# EAGLE design brainwave (EAGLE 6.2)
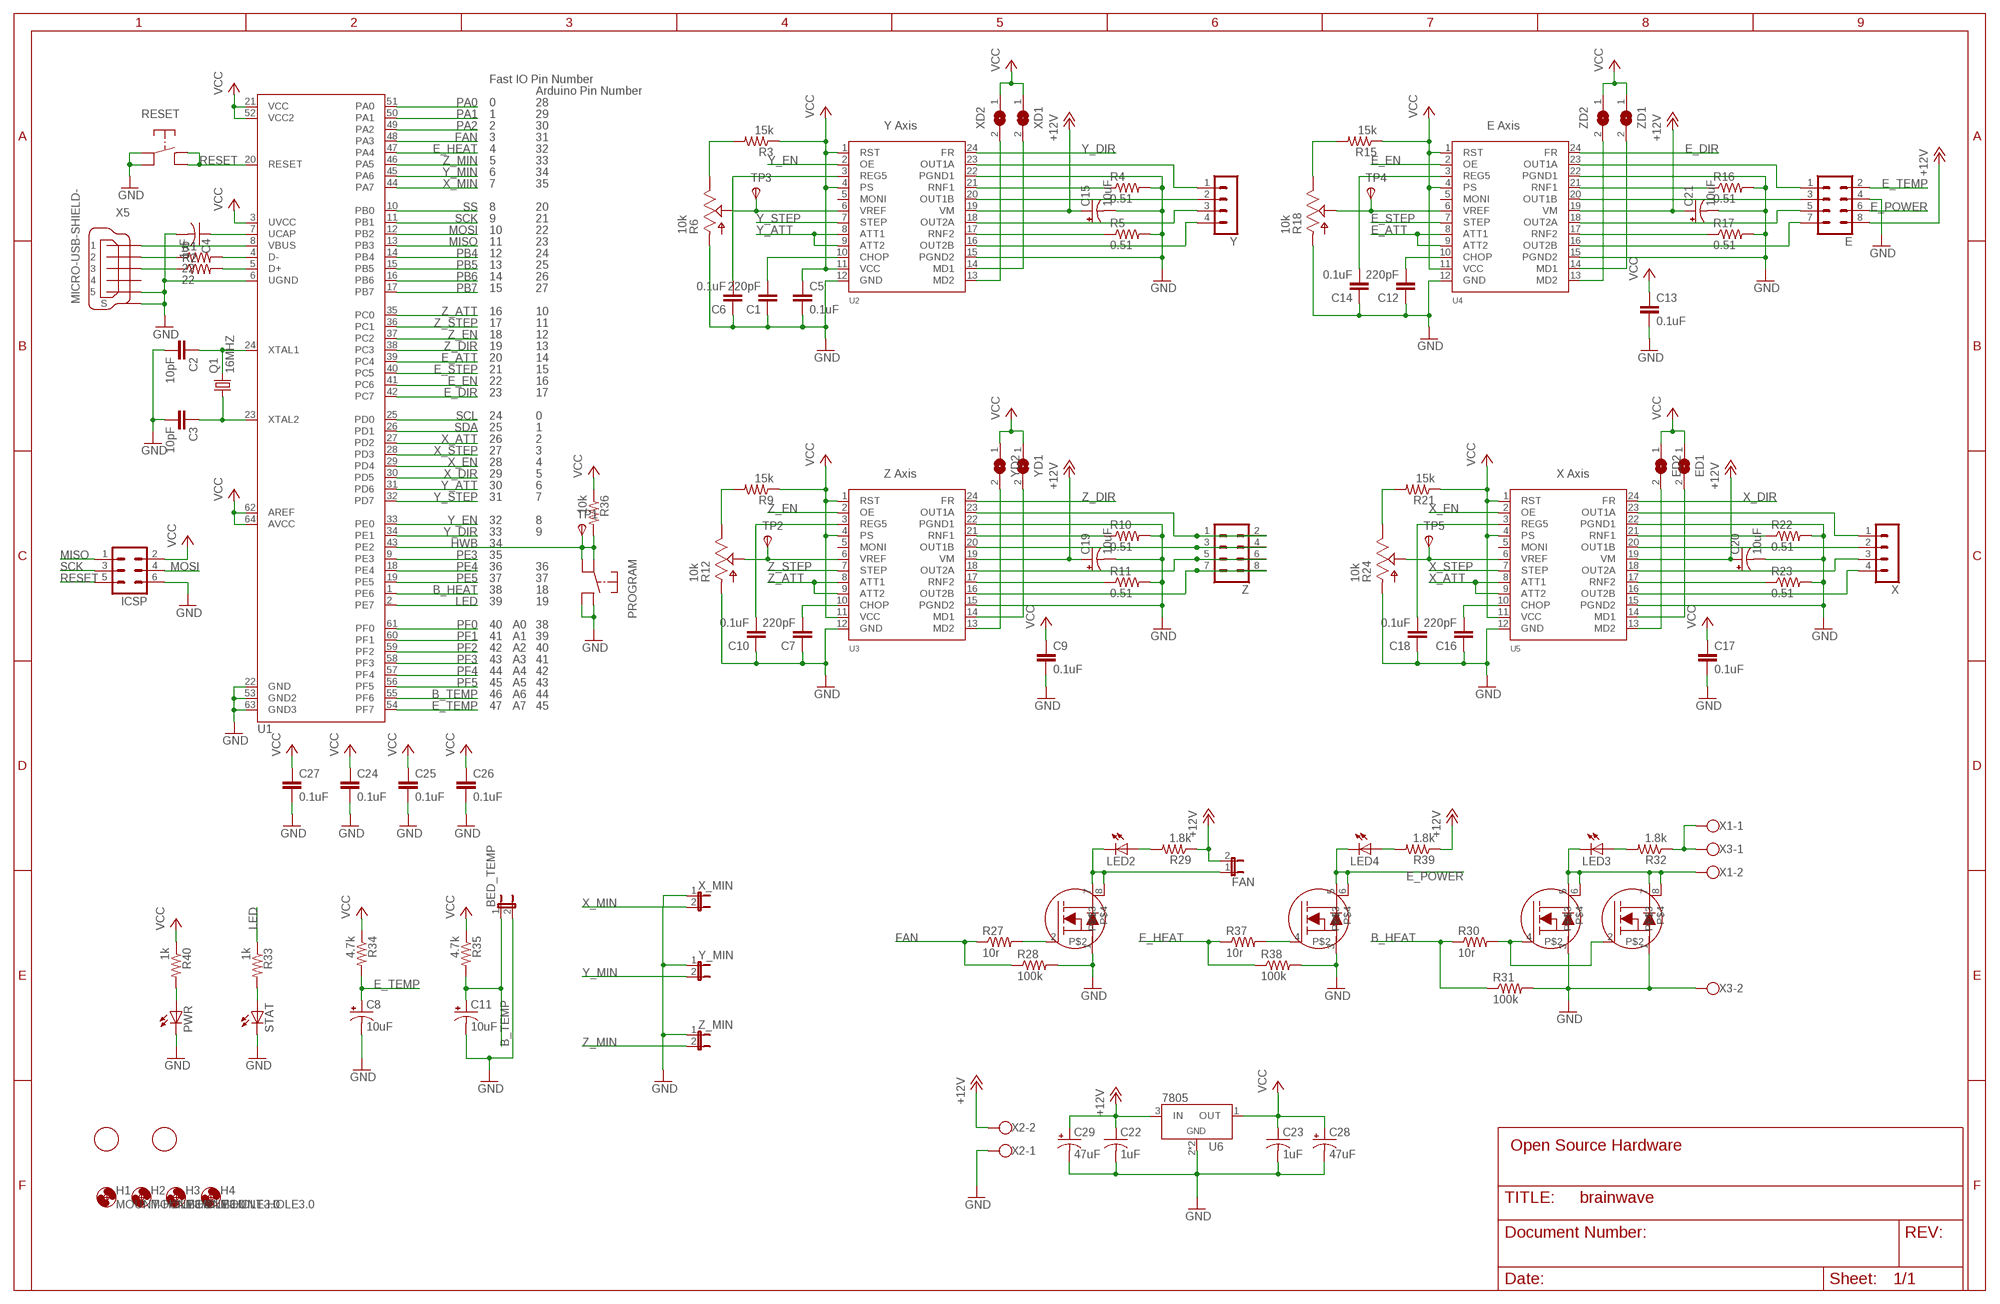
[diagram p0: schematic, sheet 1]

## Parts
BED_TEMP  JP1E  [JP1]
C1  220pF  C-EUC0603  [C0603]
C2  10pF  C-EUC0603  [C0603]
C3  10pF  C-EUC0603  [C0603]
C4  1uF  C-USC0603  [C0603]
C5  0.1uF  C-EUC0603  [C0603]
C6  0.1uF  C-EUC0603  [C0603]
C7  220pF  C-EUC0603  [C0603]
C8  10uF  CPOL-US153CLV-0505  [153CLV-0505]
C9  0.1uF  C-EUC0603  [C0603]
C10  0.1uF  C-EUC0603  [C0603]
C11  10uF  CPOL-US153CLV-0505  [153CLV-0505]
C12  220pF  C-EUC0603  [C0603]
C13  0.1uF  C-EUC0603  [C0603]
C14  0.1uF  C-EUC0603  [C0603]
C15  10uF  CPOL-US153CLV-0505  [153CLV-0505]
C16  220pF  C-EUC0603  [C0603]
C17  0.1uF  C-EUC0603  [C0603]
C18  0.1uF  C-EUC0603  [C0603]
C19  10uF  CPOL-US153CLV-0505  [153CLV-0505]
C20  10uF  CPOL-US153CLV-0505  [153CLV-0505]
C21  10uF  CPOL-US153CLV-0505  [153CLV-0505]
C22  1uF  C-USC0603  [C0603]
C23  1uF  C-USC0603  [C0603]
C24  0.1uF  C-EUC0603  [C0603]
C25  0.1uF  C-EUC0603  [C0603]
C26  0.1uF  C-EUC0603  [C0603]
C27  0.1uF  C-EUC0603  [C0603]
C28  47uF  CPOL-US153CLV-0605  [153CLV-0605]
C29  47uF  CPOL-US153CLV-0605  [153CLV-0605]
E  MA04-2  [MA04-2]
ED1  SJ  [SJ]
ED2  SJ  [SJ]
FAN  JP1E  [JP1]
H1  MOUNT-HOLE3.0  [3,0]
H2  MOUNT-HOLE3.0  [3,0]
H3  MOUNT-HOLE3.0  [3,0]
H4  MOUNT-HOLE3.0  [3,0]
ICSP  MA03-2  [MA03-2]
LED2  LEDCHIPLED_0805  [CHIPLED_0805]
LED3  LEDCHIPLED_0805  [CHIPLED_0805]
LED4  LEDCHIPLED_0805  [CHIPLED_0805]
PROGRAM  PTS645SMT  [PTS645-SMTR]
PWR  LEDCHIPLED_0805  [CHIPLED_0805]
Q1  16MHZ  CRYSTALCSM-3X  [CSM-3X]
R1  22  R-US_R0603  [R0603]
R2  22  R-US_R0603  [R0603]
R3  15k  R-US_R0603  [R0603]
R4  0.51  R-US_R2512  [R2512]
R5  0.51  R-US_R2512  [R2512]
R6  10k  PVZ3A  [PVZ3A]
R9  15k  R-US_R0603  [R0603]
R10  0.51  R-US_R2512  [R2512]
R11  0.51  R-US_R2512  [R2512]
R12  10k  PVZ3A  [PVZ3A]
R15  15k  R-US_R0603  [R0603]
R16  0.51  R-US_R2512  [R2512]
R17  0.51  R-US_R2512  [R2512]
R18  10k  PVZ3A  [PVZ3A]
R21  15k  R-US_R0603  [R0603]
R22  0.51  R-US_R2512  [R2512]
R23  0.51  R-US_R2512  [R2512]
R24  10k  PVZ3A  [PVZ3A]
R27  10r  R-US_R0603  [R0603]
R28  100k  R-US_R0603  [R0603]
R29  1.8k  R-US_R0603  [R0603]
R30  10r  R-US_R0603  [R0603]
R31  100k  R-US_R0603  [R0603]
R32  1.8k  R-US_R0603  [R0603]
R33  1k  R-US_R0603  [R0603]
R34  4.7k  R-US_R0603  [R0603]
R35  4.7k  R-US_R0603  [R0603]
R36  10k  R-US_R0603  [R0603]
R37  10r  R-US_R0603  [R0603]
R38  100k  R-US_R0603  [R0603]
R39  1.8k  R-US_R0603  [R0603]
R40  1k  R-US_R0603  [R0603]
RESET  PTS645SMT  [PTS645-SMTR]
STAT  LEDCHIPLED_0805  [CHIPLED_0805]
TP1  TPSTP08R  [TP08R]
TP2  TPSTP08R  [TP08R]
TP3  TPSTP08R  [TP08R]
TP4  TPSTP08R  [TP08R]
TP5  TPSTP08R  [TP08R]
U1  AT90USB64/128  [TQFP64]
U2  LV8713T  [TSSOP24]
U3  LV8713T  [TSSOP24]
U4  LV8713T  [TSSOP24]
U5  LV8713T  [TSSOP24]
U6  7805  78  [SOT89]
U7  IRF8313PBF  [SO8]
U8  IRF8313PBF  [SO8]
U$1  FIDUCIAL  [FIDUCIAL_1MM]
U$2  FIDUCIAL  [FIDUCIAL_1MM]
X  MA04-1  [MA04-1]
X1  W237-102  [W237-102]
X2  W237-102  [W237-102]
X3  W237-102  [W237-102]
X5  MICRO-USB-SHIELD-  [10118192-0001LF]
X_MIN  JP1E  [JP1]
XD1  SJ  [SJ]
XD2  SJ  [SJ]
Y  MA04-1  [MA04-1]
Y_MIN  JP1E  [JP1]
YD1  SJ  [SJ]
YD2  SJ  [SJ]
Z  MA04-2  [MA04-2]
Z_MIN  JP1E  [JP1]
ZD1  SJ  [SJ]
ZD2  SJ  [SJ]

## Nets
+12V [Power]: C15.+ C19.+ C20.+ C21.+ C22.1 C29.+ E.8 FAN.2 R29.1 R39.1 U2.19(VM) U3.19(VM) U4.19(VM) U5.19(VM) U6.3(IN) X2.2
B_HEAT: R30.1 R31.1 U1.1(PE6)
B_TEMP: BED_TEMP.1 C11.+ R35.2 U1.55(PF6)
BED_POWER [Power]: R32.1 X1.1 X3.1
E_ATT: U1.39(PC4) U4.8(ATT1) U4.9(ATT2)
E_DIR: U1.42(PC7) U4.24(FR)
E_EN: U1.41(PC6) U4.2(OE)
E_HEAT: R37.1 R38.1 U1.47(PA4)
E_POWER [Power Bus]: E.6 LED4.C U7.5 U7.6
E_STEP: U1.40(PC5) U4.7(STEP)
E_TEMP: C8.+ E.2 R34.2 U1.54(PF7)
FAN: R27.1 R28.1 U1.48(PA3)
GND: BED_TEMP.2 C1.1 C2.2 C3.2 C4.2 C5.2 C6.1 C7.1 C8.- C9.2 C10.1 C11.- C12.1 C13.2 C14.1 C15.- C16.1 C17.2 C18.1 C19.- C20.- C21.- C22.2 C23.2 C24.2 C25.2 C26.2 C27.2 C28.- C29.- E.4 ICSP.6 PROGRAM.P$3 PROGRAM.P$4 PWR.C R4.2 R5.2 R6.P$1 R10.2 R11.2 R12.P$1 R16.2 R17.2 R18.P$1 R22.2 R23.2 R24.P$1 R28.2 R31.2 R38.2 RESET.P$1 RESET.P$2 STAT.C U1.6(UGND) U1.22(GND) U1.53(GND2) U1.63(GND3) U2.12(GND) U2.15(PGND2) U2.22(PGND1) U3.12(GND) U3.15(PGND2) U3.22(PGND1) U4.12(GND) U4.15(PGND2) U4.22(PGND1) U5.12(GND) U5.15(PGND2) U5.22(PGND1) U6.2(GND) U6.2@1(GND) U7.1 U7.3 U8.1 U8.3 X2.1 X3.2 X5.5 X5.M1(S) X5.M2(S) X5.M3(S) X5.M4(S) X5.M5(S) X5.M6(S) X_MIN.1 Y_MIN.1 Z_MIN.1
HWB: PROGRAM.P$1 PROGRAM.P$2 R36.2 TP1.TP(PP) U1.43(PE2)
LED: R33.1 U1.2(PE7)
MISO: ICSP.1 U1.13(PB3)
MOSI: ICSP.4 U1.12(PB2)
N$1: U1.8(VBUS) X5.1
N$2: R1.1 X5.2
N$3: R2.1 X5.3
N$4: U3.20(OUT1B) Z.3 Z.4
N$5: C4.1 U1.7(UCAP)
N$6: C2.1 Q1.2 U1.24(XTAL1)
N$7: C3.1 Q1.1 U1.23(XTAL2)
N$8: R6.P$2 TP3.TP(PP) U2.6(VREF)
N$9: R4.1 U2.21(RNF1)
N$10: R5.1 U2.17(RNF2)
N$11 [Power]: U2.16(OUT2B) Y.4
N$12 [Power]: U2.18(OUT2A) Y.3
N$13 [Power]: U2.20(OUT1B) Y.2
N$14 [Power]: U2.23(OUT1A) Y.1
N$15: C1.2 U2.10(CHOP)
N$16: C6.2 U2.3(REG5)
N$17: R3.2 R6.P$3
N$18: U2.13(MD2) XD2.2
N$19: U2.14(MD1) XD1.2
N$20: R30.2 U8.2 U8.4
N$21: R10.1 U3.21(RNF1)
N$22: R11.1 U3.17(RNF2)
N$23 [Power]: U3.16(OUT2B) Z.7 Z.8
N$24 [Power]: U3.18(OUT2A) Z.5 Z.6
N$26 [Power]: U3.23(OUT1A) Z.1 Z.2
N$27: C7.2 U3.10(CHOP)
N$28: C10.2 U3.3(REG5)
N$29: R12.P$2 TP2.TP(PP) U3.6(VREF)
N$30: R9.2 R12.P$3
N$31: U3.13(MD2) YD2.2
N$32: U3.14(MD1) YD1.2
N$33: R33.2 STAT.A
N$34: R37.2 U7.4
N$36: LED4.A R39.2
N$37: PWR.A R40.2
N$81: R16.1 U4.21(RNF1)
N$82: R17.1 U4.17(RNF2)
N$83 [Power]: E.7 U4.16(OUT2B)
N$84 [Power]: E.5 U4.18(OUT2A)
N$85 [Power]: E.3 U4.20(OUT1B)
N$86 [Power]: E.1 U4.23(OUT1A)
N$87: C12.2 U4.10(CHOP)
N$88: C14.2 U4.3(REG5)
N$89: R18.P$2 TP4.TP(PP) U4.6(VREF)
N$90: R15.2 R18.P$3
N$91: U4.13(MD2) ZD2.2
N$92: U4.14(MD1) ZD1.2
N$93: R22.1 U5.21(RNF1)
N$94: R23.1 U5.17(RNF2)
N$95 [Power]: U5.16(OUT2B) X.4
N$96 [Power]: U5.18(OUT2A) X.3
N$97 [Power]: U5.20(OUT1B) X.2
N$98 [Power]: U5.23(OUT1A) X.1
N$99: C16.2 U5.10(CHOP)
N$100: C18.2 U5.3(REG5)
N$101: R24.P$2 TP5.TP(PP) U5.6(VREF)
N$102: R21.2 R24.P$3
N$103: ED2.2 U5.13(MD2)
N$104: ED1.2 U5.14(MD1)
N$105: R27.2 U7.2
N$107: LED2.A R29.2
N$108 [Power Bus]: FAN.1 LED2.C U7.7 U7.8
N$111 [Bed Heat]: LED3.C U8.5 U8.6 U8.7 U8.8 X1.2
N$112: LED3.A R32.2
PA0: U1.51(PA0)
PA1: U1.50(PA1)
PA2: U1.49(PA2)
PB4: U1.14(PB4)
PB5: U1.15(PB5)
PB6: U1.16(PB6)
PB7: U1.17(PB7)
PE3: U1.9(PE3)
PE4: U1.18(PE4)
PE5: U1.19(PE5)
PF0: U1.61(PF0)
PF1: U1.60(PF1)
PF2: U1.59(PF2)
PF3: U1.58(PF3)
PF4: U1.57(PF4)
PF5: U1.56(PF5)
RESET: ICSP.5 RESET.P$3 RESET.P$4 U1.20(RESET)
SCK: ICSP.3 U1.11(PB1)
SCL: U1.25(PD0)
SDA: U1.26(PD1)
SS [Power]: U1.10(PB0)
USB1_N: R1.2 U1.4(D-)
USB1_P: R2.2 U1.5(D+)
VCC: C5.1 C9.1 C13.1 C17.1 C23.1 C24.1 C25.1 C26.1 C27.1 C28.+ ED1.1 ED2.1 ICSP.2 R3.1 R9.1 R15.1 R21.1 R34.1 R35.1 R36.1 R40.1 U1.3(UVCC) U1.21(VCC) U1.52(VCC2) U1.62(AREF) U1.64(AVCC) U2.1(RST) U2.4(PS) U2.11(VCC) U3.1(RST) U3.4(PS) U3.11(VCC) U4.1(RST) U4.4(PS) U4.11(VCC) U5.1(RST) U5.4(PS) U5.11(VCC) U6.1(OUT) XD1.1 XD2.1 YD1.1 YD2.1 ZD1.1 ZD2.1
X_ATT: U1.27(PD2) U5.8(ATT1) U5.9(ATT2)
X_DIR: U1.30(PD5) U5.24(FR)
X_EN: U1.29(PD4) U5.2(OE)
X_MIN: U1.44(PA7) X_MIN.2
X_STEP: U1.28(PD3) U5.7(STEP)
Y_ATT: U1.31(PD6) U2.8(ATT1) U2.9(ATT2)
Y_DIR: U1.34(PE1) U2.24(FR)
Y_EN: U1.33(PE0) U2.2(OE)
Y_MIN: U1.45(PA6) Y_MIN.2
Y_STEP: U1.32(PD7) U2.7(STEP)
Z_ATT: U1.35(PC0) U3.8(ATT1) U3.9(ATT2)
Z_DIR: U1.38(PC3) U3.24(FR)
Z_EN: U1.37(PC2) U3.2(OE)
Z_MIN: U1.46(PA5) Z_MIN.2
Z_STEP: U1.36(PC1) U3.7(STEP)
Unconnected: U2.5(MONI) U3.5(MONI) U4.5(MONI) U5.5(MONI) X5.4

## Notes on the sheet
- Fast IO Pin Number
- Arduino Pin Number
- 0 | 28
- 1 | 29
- 2 | 30 | Y Axis | E Axis
- 3 | 31
- 4 | 32
- 5 | 33
- 6 | 34
- 7 | 35
- 8 | 20
- 9 | 21
- 10 | 22
- 11 | 23
- 12 | 24
- 13 | 25
- 14 | 26
- 15 | 27
- 16 | 10
- 17 | 11
- 18 | 12
- 19 | 13
- 20 | 14
- 21 | 15
- 22 | 16
- 23 | 17
- 24 | 0
- 25 | 1
- 26 | 2
- 27 | 3
- 28 | 4
- 29 | 5 | Z Axis | X Axis
- 30 | 6
- 31 | 7
- 32 | 8
- 33 | 9
- 34
- 35
- 36 | 36
- 37 | 37
- 38 | 18
- 39 | 19
- 40 | A0 | 38
- 41 | A1 | 39
- 42 | A2 | 40
- 43 | A3 | 41
- 44 | A4 | 42
- 45 | A5 | 43
- 46 | A6 | 44
- 47 | A7 | 45
- Open Source Hardware

## Library data of the parts
BED_TEMP FAN X_MIN Y_MIN Z_MIN = jumper:JP1E: JUMPER
C1-C3 C5-C7 C9 C10 C12-C14 C16-C18 C24-C27 = rcl:C-EU: CAPACITOR, European symbol
C4 C22 C23 = rcl:C-US: CAPACITOR, American symbol
C8 C11 C15 C19-C21 C28 C29 = rcl:CPOL-US: POLARIZED CAPACITOR, American symbol
E Z = con-lstb:MA04-2: PIN HEADER; OC_FARNELL: unknown; OC_NEWARK: unknown
ED1 ED2 XD1 XD2 YD1 YD2 ZD1 ZD2 = jumper:SJ: SMD solder JUMPER
H1-H4 = holes:MOUNT-HOLE: MOUNTING HOLE with drill center marker
ICSP = con-lstb:MA03-2: PIN HEADER; OC_FARNELL: unknown; OC_NEWARK: unknown
LED2-LED4 PWR STAT = led:LED: LED OSRAM: - CHIPLED LG R971, LG N971, LY N971, LG Q971, LY Q971, LO R971, LY R971 LH N974, LH R974 LS Q976, LO Q976, LY Q976 LO Q996 - Hyper CHIPLED LW Q18S LB Q993, LB Q99A, LB R99A - SideLED LS A670, LO A670, LY A670, LG A670, LP A670 LB A673, LV A673, LT A673, LW A673 LH A674 LY A675 LS A676, LA A676, LO A676, LY A676, LW A676 LS A679, LY A679, LG A679 - Hyper Micro SIDELED® LS Y876, LA Y876, LO Y876, LY Y876 LT Y87S - SmartLED LW L88C, LW L88S LB L89C, LB L89S, LG L890 LS L89K, LO L89K, LY L89K LS L896, LA L896, LO L896, LY L896 - TOPLED LS T670, LO T670, LY T670, LG T670, LP T670 LSG T670, LSP T670, LSY T670, LOP T670, LYG T670 LG T671, LOG T671, LSG T671 LB T673, LV T673, LT T673, LW T673 LH T674 LS T676, LA T676, LO T676, LY T676, LB T676, LH T676, LSB T676, LW T676 LB T67C, LV T67C, LT T67C, LS T67K, LO T67K, LY T67K, LW E67C LS E67B, LA E67B, LO E67B, LY E67B, LB E67C, LV E67C, LT E67C LW T67C LS T679, LY T679, LG T679 LS T770, LO T770, LY T770, LG T770, LP T770 LB T773, LV T773, LT T773, LW T773 LH T774 LS E675, LA E675, LY E675, LS T675 LS T776, LA T776, LO T776, LY T776, LB T776 LHGB T686 LT T68C, LB T68C - Hyper Mini TOPLED® LB M676 - Mini TOPLED Santana® LG M470 LS M47K, LO M47K, LY M47K Source: http://www.osram.convergy.de LUXEON: - LUMILED® LXK2-PW12-R00, LXK2-PW12-S00, LXK2-PW14-U00, LXK2-PW14-V00 LXK2-PM12-R00, LXK2-PM12-S00, LXK2-PM14-U00 LXK2-PE12-Q00, LXK2-PE12-R00, LXK2-PE12-S00, LXK2-PE14-T00, LXK2-PE14-U00 LXK2-PB12-K00, LXK2-PB12-L00, LXK2-PB12-M00, LXK2-PB14-N00, LXK2-PB14-P00, LXK2-PB14-Q00 LXK2-PR12-L00, LXK2-PR12-M00, LXK2-PR14-Q00, LXK2-PR14-R00 LXK2-PD12-Q00, LXK2-PD12-R00, LXK2-PD12-S00 LXK2-PH12-R00, LXK2-PH12-S00 LXK2-PL12-P00, LXK2-PL12-Q00, LXK2-PL12-R00 Source: www.luxeon.com KINGBRIGHT: KA-3528ASYC Source: www.kingbright.com
PROGRAM RESET = shinythings:PTS645
Q1 = shinythings:CRYSTAL: SMD CRYSTAL Source: www.ecsxtal.com .. Crystal 3.6864MHz CSM_7X_DU.PDF
R1-R5 R9-R11 R15-R17 R21-R23 R27-R40 = rcl:R-US_: RESISTOR, American symbol
R6 R12 R18 R24 = shinythings:PVZ3A
TP1-TP5 = testpad:TPS: TEST PIN
U1 = shinythings:AT90USB64/128
U2-U5 = shinythings:LV8713T: PWM Constant-Current Control Stepping Motor Driver
U6 = shinythings:78**
U7 U8 = shinythings:IRF8313PBF
U$1 U$2 = shinythings:FIDUCIAL: For use by pick and place machines to calibrate the vision/machine, 1mm By microbuilder.eu
X Y = shinythings:MA04-1: PIN HEADER; OC_FARNELL: unknown; OC_NEWARK: unknown
X1-X3 = con-wago-500:W237-102: WAGO SCREW CLAMP; MPN: 237-102; OC_FARNELL: unknown; OC_NEWARK: 70K9898
X5 = shinythings:MICRO-USB-SHIELD-: MINI USB Connector Source: http://www.hirose.co.jp/cataloge_hp/e24000019.pdf

## Net classes
0 default: width 0.178 mm, drill 0.406 mm, clearance 0.178 mm
1 Power: width 0.3 mm, drill 0.406 mm, clearance 0.178 mm
2 Power Bus: width 0.5 mm, drill 0.508 mm, clearance 0.178 mm
3 Bed Heat: width 1 mm, drill 0.508 mm, clearance 0.178 mm

## Board
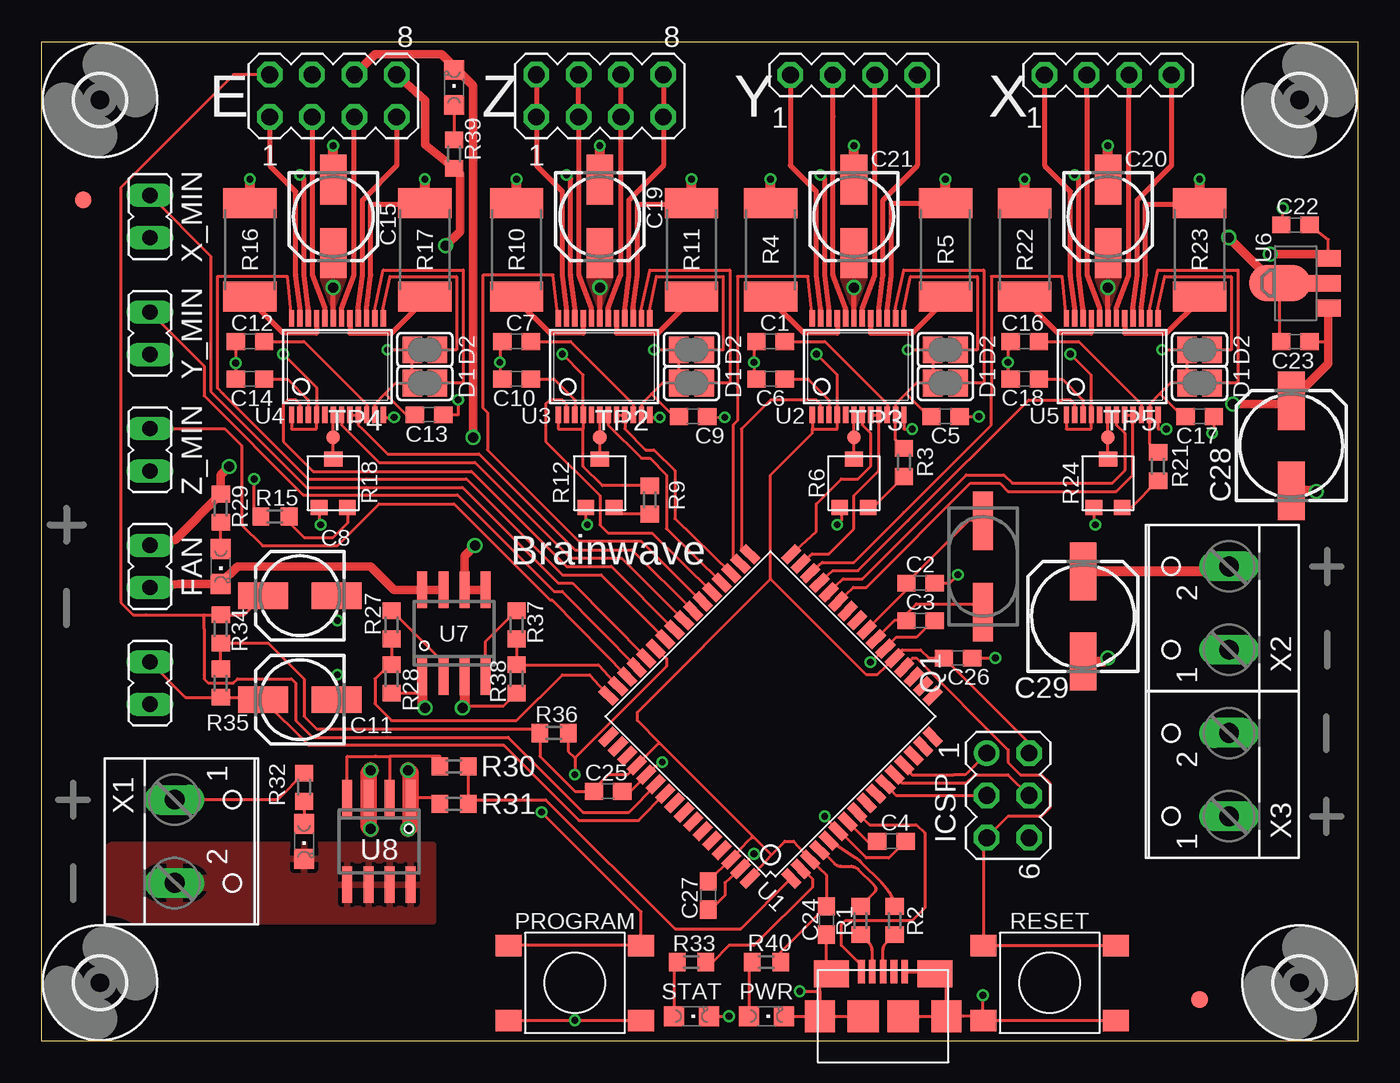
[diagram p1: board, top side]
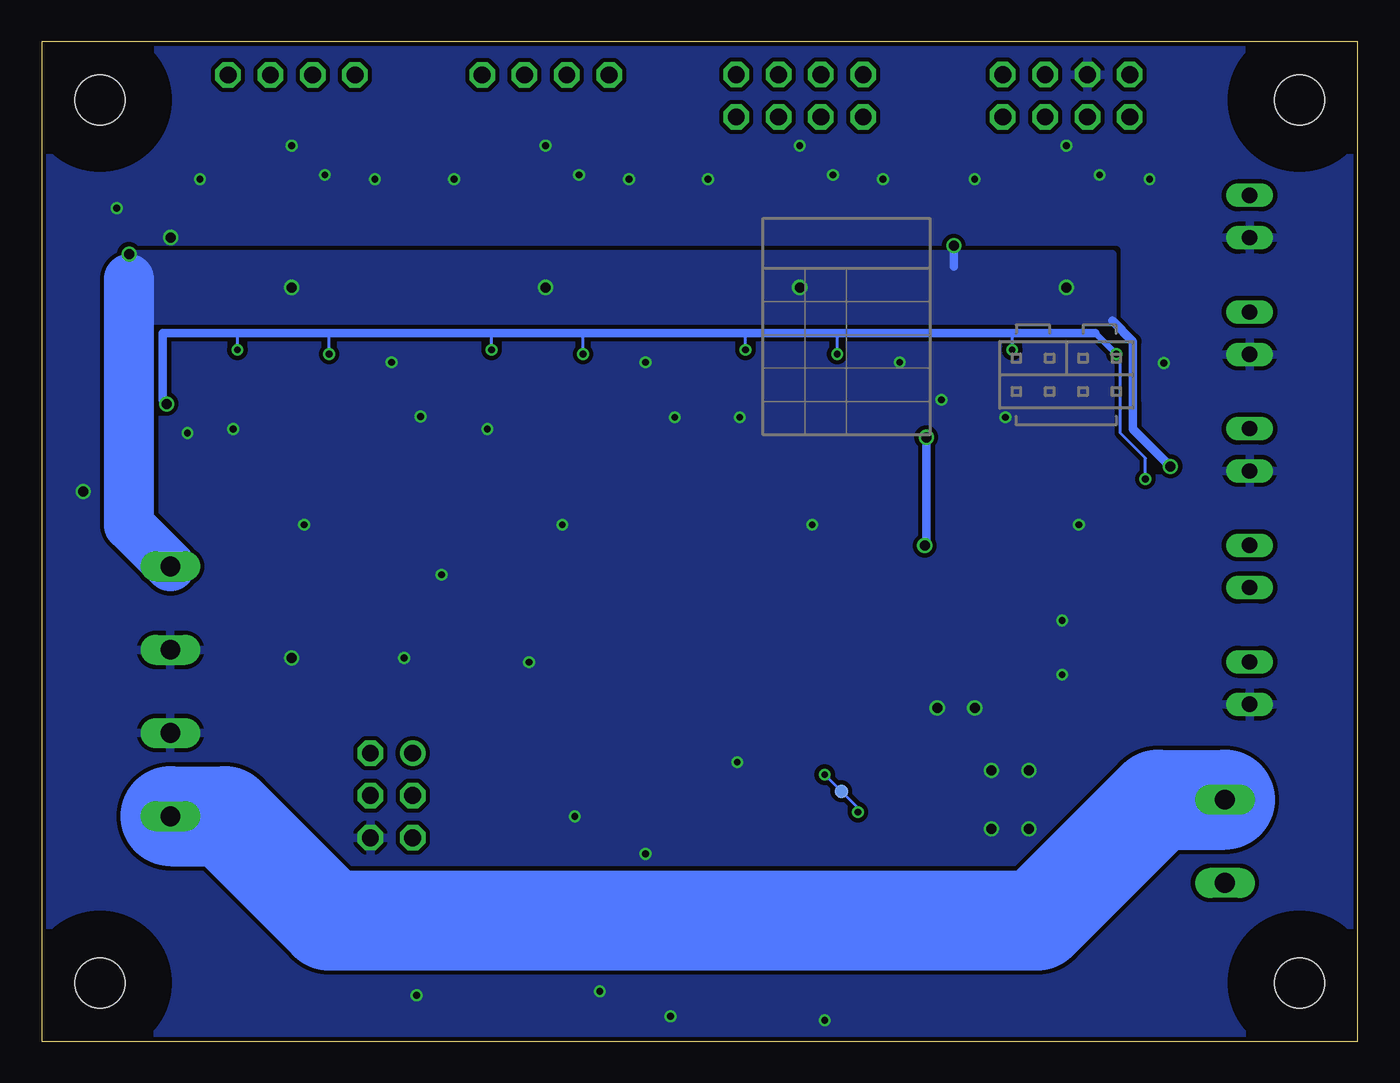
[diagram p2: board, bottom side, seen from below]

Size 79 x 60 mm. Coordinates in mm from the lower left corner, seen from the top.
Outline: 79,0 0,0 0,60 79,60 79,0
Copper layers (1*16): Top 0.035mm / dielectric 1.5mm / Bottom 0.035mm
Design rules: minimum track width 6mil, minimum drill 12mil, track to track 6mil, track to pad 6mil, pad to pad 6mil, via to via 6mil, smd to smd 0mil, copper to edge 10mil, drill to drill 10mil, minimum pad ring 10mil, minimum via ring 6mil, stop-mask expansion 2mil, vias tented up to drill 100mil, thermal gap 10mil

### Footprints (pad centres in the part's own frame; a part is rotated, then mirrored left to right if it is on the bottom)
JP1 = drill 0.914 long: 1 0,-1.27; 2 0,1.27
C0603 = smd 1.1 x 1: 1 -0.85,0; 2 0.85,0
153CLV-0505 = smd 3 x 1.6: + 2.2,0; - -2.2,0
153CLV-0605 = smd 3.5 x 1.6: + 2.7,0; - -2.7,0
MA04-2 = drill 1.016 octagon: 1 -3.81,-1.27; 2 -3.81,1.27; 3 -1.27,-1.27; 4 -1.27,1.27; 5 1.27,-1.27; 6 1.27,1.27; 7 3.81,-1.27; 8 3.81,1.27
SJ = smd 1.168 x 1.6: 1 -0.762,0; 2 0.762,0
3,0 = hole 3: 0,0
MA03-2 = drill 1.016: 1 -2.54,-1.27 | drill 1.016 octagon: 2 -2.54,1.27; 3 0,-1.27; 4 0,1.27; 5 2.54,-1.27; 6 2.54,1.27
CHIPLED_0805 = smd 1.2 x 1.2: A 0,-1.05; C 0,1.05
PTS645-SMTR = smd 1.55 x 1.3: P$1 -3.975,2.25; P$2 3.975,2.25; P$3 -3.975,-2.25; P$4 3.975,-2.25
CSM-3X = smd 3.5 x 1.2: 1 -2.75,0; 2 2.75,0
R0603 = smd 1 x 1.1: 1 -0.85,0; 2 0.85,0
R2512 = smd 1.8 x 3.2: 1 -2.8,0; 2 2.8,0
PVZ3A = smd 1 x 0.9: P$1 -0.85,-1.45; P$3 0.85,-1.45 | smd 1.1 x 0.9: P$2 0,1.45
TP08R = smd 0.8 x 0.8: TP 0,0
TQFP64 = smd 1.2 x 0.55: 1 -7.75,6; 2 -7.75,5.2; 3 -7.75,4.4; 4 -7.75,3.6; 5 -7.75,2.8; 6 -7.75,2; 7 -7.75,1.2; 8 -7.75,0.4; 9 -7.75,-0.4; 10 -7.75,-1.2; 11 -7.75,-2; 12 -7.75,-2.8; 13 -7.75,-3.6; 14 -7.75,-4.4; 15 -7.75,-5.2; 16 -7.75,-6; 33 7.75,-6; 34 7.75,-5.2; 35 7.75,-4.4; 36 7.75,-3.6; 37 7.75,-2.8; 38 7.75,-2; 39 7.75,-1.2; 40 7.75,-0.4; 41 7.75,0.4; 42 7.75,1.2; 43 7.75,2; 44 7.75,2.8; 45 7.75,3.6; 46 7.75,4.4; 47 7.75,5.2; 48 7.75,6 | smd 0.55 x 1.2: 17 -6,-7.75; 18 -5.2,-7.75; 19 -4.4,-7.75; 20 -3.6,-7.75; 21 -2.8,-7.75; 22 -2,-7.75; 23 -1.2,-7.75; 24 -0.4,-7.75; 25 0.4,-7.75; 26 1.2,-7.75; 27 2,-7.75; 28 2.8,-7.75; 29 3.6,-7.75; 30 4.4,-7.75; 31 5.2,-7.75; 32 6,-7.75; 49 6,7.75; 50 5.2,7.75; 51 4.4,7.75; 52 3.6,7.75; 53 2.8,7.75; 54 2,7.75; 55 1.2,7.75; 56 0.4,7.75; 57 -0.4,7.75; 58 -1.2,7.75; 59 -2,7.75; 60 -2.8,7.75; 61 -3.6,7.75; 62 -4.4,7.75; 63 -5.2,7.75; 64 -6,7.75
TSSOP24 = smd 0.32 x 1: 1 -2.75,-2.9; 2 -2.25,-2.9; 3 -1.75,-2.9; 4 -1.25,-2.9; 5 -0.75,-2.9; 6 -0.25,-2.9; 7 0.25,-2.9; 8 0.75,-2.9; 9 1.25,-2.9; 10 1.75,-2.9; 11 2.25,-2.9; 12 2.75,-2.9; 13 2.75,2.9; 14 2.25,2.9; 15 1.75,2.9; 16 1.25,2.9; 17 0.75,2.9; 18 0.25,2.9; 19 -0.25,2.9; 20 -0.75,2.9; 21 -1.25,2.9; 22 -1.75,2.9; 23 -2.25,2.9; 24 -2.75,2.9
SOT89 = smd 1 x 1.5: 1 -1.499,-1.981; 3 1.499,-1.981 | smd 1 x 2: 2 0,-1.727 | smd 2.2 x 3.7: 2@1 0,0.94
SO8 = smd 0.6 x 2.2: 1 -1.905,-2.6; 2 -0.635,-2.6; 3 0.635,-2.6; 4 1.905,-2.6; 5 1.905,2.6; 6 0.635,2.6; 7 -0.635,2.6; 8 -1.905,2.6
FIDUCIAL_1MM = smd 1 x 1: 1 0,0
MA04-1 = drill 1.016 octagon: 1 -3.81,0; 2 -1.27,0; 3 1.27,0; 4 3.81,0
W237-102 = drill 1.194 long: 1 -2.5,-1.27; 2 2.5,-1.27
10118192-0001LF = smd 0.4 x 1.4: 1 -1.3,2.675; 2 -0.65,2.675; 3 0,2.675; 4 0.65,2.675; 5 1.3,2.675 | smd 1.8 x 1.9: M1 3.8,0; M2 -3.8,0 | smd 2.1 x 1.6: M3 -3.1,2.55; M4 3.1,2.55 | smd 1.9 x 1.9: M5 1.2,0; M6 -1.2,0

### Placement (x,y rotation side)
BED_TEMP  6.5,21.5 180 top
C1  43.75,42 0 top
C2  52.75,27.5 0 top
C3  52.75,25.25 0 top
C4  51,12 0 top
C5  54.25,37.5 0 top
C6  43.75,39.75 0 top
C7  28.5,42 0 top
C8  15.5,26.75 180 top
C9  39.1,37.5 0 top
C10  28.5,39.75 0 top
C11  15.5,20.5 180 top
C12  12.5,42 0 top
C13  23.25,37.6 0 top
C14  12.5,39.75 0 top
C15  17.5,49.5 270 top
C16  59,42 0 top
C17  69.5,37.5 0 top
C18  59,39.75 0 top
C19  33.5,49.5 270 top
C20  64,49.5 270 top
C21  48.75,49.5 270 top
C22  75.25,49 180 top
C23  75.25,42 180 top
C24  47.1,7.25 270 top
C25  34,15 0 top
C26  55,23 0 top
C27  40,8.75 270 top
C28  75,35.75 90 top
C29  62.5,25.5 90 top
E  17.5,56.75 0 top
ED1  69.5,39.5 0 top
ED2  69.5,41.5 0 top
FAN  6.5,28.5 0 top
H1  3.5,3.5 0 top
H2  3.5,56.5 0 top
H3  75.5,56.5 0 top
H4  75.5,3.5 0 top
ICSP  58,14.75 270 top
LED2  10.75,28.5 180 top
LED3  15.75,12 180 top
LED4  24.75,57.25 0 top
PROGRAM  32,3.5 0 top
PWR  43.5,1.5 270 top
Q1  56.5,28.5 90 top
R1  49.15,7.25 90 top
R2  51.2,7.25 90 top
R3  51.75,34.75 270 top
R4  43.75,47.5 90 top
R5  54.25,47.5 90 top
R6  48.75,33.5 0 top
R9  36.5,32.5 270 top
R10  28.5,47.5 90 top
R11  39,47.5 90 top
R12  33.5,33.5 0 top
R15  14,31.5 0 top
R16  12.5,47.5 90 top
R17  23,47.5 90 top
R18  17.5,33.5 0 top
R21  67,34.5 270 top
R22  59,47.5 90 top
R23  69.5,47.5 90 top
R24  64,33.5 0 top
R27  21,25 90 top
R28  21,21.75 270 top
R29  10.75,32 270 top
R30  24.75,16.5 180 top
R31  24.75,14.25 180 top
R32  15.75,15.25 270 top
R33  39,4.75 180 top
R34  10.75,24.75 90 top
R35  10.75,21.5 270 top
R36  30.75,18.5 0 top
R37  28.5,25 90 top
R38  28.5,21.75 270 top
R39  24.75,53.25 90 top
R40  43.5,4.75 180 top
RESET  60.5,3.5 180 top
STAT  39,1.5 270 top
TP1  31,15 0 bottom
TP2  33.5,36.25 0 top
TP3  48.75,36.25 0 top
TP4  17.5,36.25 0 top
TP5  64,36.25 0 top
U1  43.75,19.5 135 top
U2  49,40.5 0 top
U3  33.75,40.5 0 top
U4  17.75,40.5 0 top
U5  64.25,40.5 0 top
U6  75.25,45.5 90 top
U7  24.75,24.5 0 top
U8  20.25,12 180 top
U$1  2.5,50.5 0 top
U$2  69.5,2.5 0 top
X  64,58 0 top
X1  9.25,12 270 top
X2  70,26 90 top
X3  70,16 90 top
X5  50.5,1.5 0 top
X_MIN  6.5,49.5 0 top
XD1  54.25,39.5 0 top
XD2  54.25,41.5 0 top
Y  48.75,58 0 top
Y_MIN  6.5,42.5 0 top
YD1  39,39.5 0 top
YD2  39,41.5 0 top
Z  33.5,56.75 0 top
Z_MIN  6.5,35.5 0 top
ZD1  23,39.5 0 top
ZD2  23,41.5 0 top

### Tracks (layer width: path | path; a pad name or v marks a point on that pad's centre or on a via)
+12V  (via drill 0.6, 0.6 pad 0.51)
  Top 0.178: U6.3 77.23,48.12 C22.1
  Top 0.3: U4.19 17.5,43.5 v17.5,45.25 | U3.19 v33.5,45.25 | U2.19 v48.75,45.25 | U5.19 v64,45.25
  Top 0.5: E.8 23,56.5 23,53.83 24.25,52.83 24.68,52.45 25.1,52.08 25.1,48.6 v24.25,47.75 | U6.3 76.98,47.25 v73.75,47.25 | v11.25,34.5 10.75,34 R29.1 8,30.1 FAN.2
  Top 0.6: R39.1 24.7,52.45 24.68,52.45 | X2.2 70.97,28.2 C29.+
  Bottom 0.5: v24.25,47.75 24.25,46.5 | v73.75,47.25 73.75,46 73.75,45.75 | 14.75,43.25 13.5,42 13.5,38.25 13.5,36.75 v11.25,34.5
  Bottom 3: X2.2 73.75,30.98 73.75,45.75
  pour Bottom: 14.75,47.25 73.5,47.25 73.5,43.25 14.75,43.25
  pour Top (no thermals): 32.7,45.8 34.3,45.8 33.7,43.9 33.3,43.9
  pour Top (no thermals): 63.2,45.8 64.8,45.8 64.2,43.9 63.8,43.9
  pour Top (no thermals): 47.95,45.8 49.55,45.8 48.95,43.9 48.55,43.9
  pour Top (no thermals): 16.7,45.8 18.3,45.8 17.7,43.9 17.3,43.9
B_HEAT
  Top 0.178: R30.1 R31.1 26,14.5 30.25,14.5 38,6.75 41.97,6.75 U1.1
B_TEMP
  Top 0.178: BED_TEMP.1 8.62,20.65 R35.2 13.15,20.65 C11.+ 16.05,17.75 27.75,17.75 32.25,13.25 35.83,13.25 U1.55 37.4,14.8
BED_POWER
  Top 0.178: R32.1 14.15,14.5 X1.1
  Bottom 6: X3.1 68,13.5 61.75,7.25 19.25,7.25 12,14.5 X1.1
E_ATT
  Top 0.178: U4.8 U4.9 19,37 19.25,36.75 20.75,35.25 26.25,35.25 32,29.5 35.42,29.5 U1.39
E_DIR
  Top 0.178: 14.75,45.9 U4.24 14.75,45.9 | 14.75,45.9 10.55,45.9 | 14.75,45.9 10.55,45.9 | 10.55,45.9 10.55,39.2 10.9,38.85 16,33.75 19.5,33.75 25.5,33.75 31.25,28 33.58,28 U1.42
E_EN
  Top 0.178: U4.2 15.5,38.25 15.25,38.5 14.75,38.5 14.5,38.25 14.5,36 16.3,34.2 19.5,34.2 25.8,34.2 31.5,28.5 34.19,28.5 U1.41
E_HEAT
  Top 0.178: 34.65,21.35 U1.47 33.41,22.6 R38.1 R37.1
E_POWER  (via drill 0.6)
  Top 0.5: E.6 20,59.25 22.25,59.25 24,59.25 24.88,58.38 25.9,57.35 v25.9,36.25 | U7.5 U7.6 25.39,29.11 v26,29.75
  Top 0.6: LED4.C 24.82,58.38 24.88,58.38
  Bottom 0.5: v25.9,36.25 25.9,29.85 v26,29.75
E_STEP
  Top 0.178: U4.7 18,37 18.75,36.25 20.25,34.75 26,34.75 31.75,29 34.81,29 U1.40
E_TEMP
  Top 0.178: 13.3,27.3 C8.+ 12.15,25.6 R34.2 | 36.85,15.4 U1.54 36.87,15.37 35.25,13.75 32.5,13.75 28,18.25 20.75,18.25 16.25,18.25 15.25,19.25 15.25,21.5 15,21.75 11.75,21.75 11.5,21.5 10,21.5 9.75,21.75 9.75,22 9.75,24.75 9.75,25.6 | 9.75,25.6 6.25,25.6 5.5,25.6 4.75,26.35 4.75,51.25 11.52,58.02 E.2 | 9.75,25.6 R34.2 | R34.2 10.6,25.6
FAN
  Top 0.178: 34.1,20.65 34.1,20.8 U1.48 32.9,22 31.25,22 28.5,19.25 21,19.25 20,20.25 20,21.75 20.85,22.6 R28.1 R27.1
GND  (via drill 0.41, 0.41 pad 0.51, 0.6)
  Top 0.178: C12.1 v11.65,40.7 C14.1 | C9.2 v41,37.45 | C5.2 v56.25,37.5 | C7.1 27.5,41.85 v27.5,40.75 27.5,39.75 C10.1 | C1.1 arc90 42.75,41.85 v42.75,40.75 42.75,39.9 arc90 C6.1 | C16.1 58,42 v58,40.75 58,39.9 C18.1 | 22.75,50.25 R17.2 | v37.25,16.75 37.1,16.75 U1.53 35.35,15 C25.2 | v42.75,11.25 42.75,11.26 U1.63 41,9.51 41,8.75 40.15,7.9 C27.2 | v47,13.5 47,13.47 U1.6 47.88,12.62 49.5,11 50.85,11 C4.2 | v49.75,22.75 49.78,22.75 U1.22 51.28,24.25 52.5,24.25 53.5,25.25 C3.2 | C22.2 74.5,49.15 v74.5,50 | C23.2 74.31,42.09 U6.2@1 | 22.84,21.5 U7.1 22.84,21 | 22.84,20.75 22.84,21 | X5.5 53.48,4.17 X5.M4 54.3,3.35 X5.M1 | X5.M2 46.7,3.35 X5.M3 47.1,4.35 C24.2 | X5.M2 X5.M6 | X5.M5 X5.M1 | C8.- 17.7,25.3 v17.75,25.25 | PWR.C X5.M2 | RESET.P$2 56.27,1.5 X5.M1 | RESET.P$2 56.5,1.27 v56.5,2.75 | RESET.P$2 RESET.P$1 | C26.2 v57.25,23 | R6.P$1 48,32.05 48,31.25 v47.75,31 | R31.2 23.9,14.6 U8.1 | U5.12 67,36.75 v67.5,36.75 | U2.12 51.75,36.75 v52.25,36.75 | U3.12 36.5,37.45 v37.1,37.45 | U4.12 20.5,37.45 v21.15,37.45 | C17.2 70.35,36.5 v70.25,36.5 | v25,38.5 25,37.6 C13.2 | R28.2 22.75,20.9 22.84,21 | 25.39,20.14 27.73,20.14 R38.2 | C11.- 17.7,21.95 v17.75,22 | STAT.C v41.25,1.5 | v45.5,3 46.7,3 X5.M2 | PROGRAM.P$3 v32,1.25 PROGRAM.P$4 | C2.2 54.5,27.5 v55,28 | R18.P$1 16.65,31.1 v16.75,31 | R24.P$1 63.15,31.1 v63.25,31 | R12.P$1 32.65,31.1 v32.75,31
  Top 0.3: U4.22 16,44 15.75,46 15.75,51.75 v15.5,52 | U4.15 19.5,44 19.75,46 19.75,50.25 22.5,50.25 22.75,50.25 23,50.25 | R22.2 59,50.5 | U3.22 32,44 31.75,46 31.75,51.75 v31.5,52 | U3.15 35.5,44 35.75,46 35.75,50.25 39,50.25 R11.2 | U2.15 50.75,44 51,46 51,50.3 R5.2 | U2.22 47.25,44 47,46 47,51.75 v46.75,52 | U5.15 66,44 66.25,46 66.25,50.25 69,50.25 R23.2 | U5.22 62.5,44 62.25,46 62.25,51.75 v62,52 | 74.65,45.16 U6.2@1 | 74.65,45.84 U6.2@1 | U6.2 U6.2@1 | U6.2@1 73.5,45.5
  Top 0.5: 74.65,45.84 73.66,45.84 v71.25,48.25
  Top 0.6: R16.2 v12.5,51.75 | R17.2 v23,51.75 | C15.- v17.5,53.75 | R10.2 v28.5,51.75 | R11.2 v39,51.75 | C19.- v33.5,53.75 | C21.- v48.75,53.75 | R4.2 v43.75,51.75 | R5.2 v54.25,51.75 | 59,50.5 v59,51.75 | C20.- v64,53.75 | R23.2 v69.5,51.75 | C29.- 63.8,22.8 v64,23 | C28.- 76.45,33.05 v76.5,33 | U7.3 25.39,20.14 v25.25,20 | U7.1 22.84,21 22.84,20.16 v23,20
  Top 1: v19.75,12.75 19.61,12.88 U8.3 19.61,16.11 v19.75,16.25 | v22,16.25 22.16,16.09 U8.1 22.16,13.25 22.16,12.9 v22,12.75
  pour Bottom (isolate 0.254, rank 3): 0,0 0,60 79,60 79,0
HWB  (via drill 0.41)
  Top 0.178: PROGRAM.P$1 PROGRAM.P$2 35.98,7.78 v30,13.75 | U1.43 37.5,22.97 37.5,22.5 32,17 | 32,17 v32,16 | R36.2 31.6,17.4 32,17
  Bottom 0.178: v32,16 TP1.TP | TP1.TP 30.75,14.75 | 30.75,14.75 30,14 v30,13.75 | TP1.TP 30.75,15 30.75,14.75
LED
  Top 0.178: U1.2 45.65,10.35 46.25,9.75 46.25,9.25 42.75,5.75 41.25,5.75 40.25,4.75 R33.1
MISO
  Top 0.178: U1.13 52.26,16 54.75,16 55.44,16 ICSP.1
MOSI
  Top 0.178: U1.12 51.65,15.5 55.5,15.5 56,16 58,16 59.25,14.75 ICSP.4
N$1
  Top 0.178: X5.1 49.2,4.55 48,5.75 48,7 48.25,7.25 52.25,7.25 53,8 53,12.5 52.5,13 49.69,13 U1.8
N$2
  Top 0.178: X5.2 49.85,5.44 arc45 49.66,5.88 R1.1
N$3
  Top 0.178: X5.3 50.5,5.48 arc-45 50.66,5.86 R2.1
N$4
  Top 0.3: U3.20 33,44 32.25,46 32.25,53 32.25,54.98 Z.3 Z.4
N$5
  Top 0.178: U1.7 49.58,12 C4.1
N$6
  Top 0.178: U1.24 51.9,27.09 C2.1 55.65,31.25 Q1.2
N$7
  Top 0.178: U1.23 51.17,25.25 C3.1 51.9,25.65 52.5,26.25 56,26.25 Q1.1
N$8
  Top 0.178: R6.P$2 48.75,36 | 48.75,36 TP3.TP | TP3.TP U2.6 | TP3.TP 48.75,36
N$9
  Top 0.3: U2.21 47.75,42.5 45.75,42.5 43.75,44.5 R4.1
N$10
  Top 0.3: U2.17 49.75,42.5 52.25,42.5 53.75,44 R5.1
N$11
  Top 0.3: U2.16 50.25,44 50.5,46 50.5,50.5 52.56,52.56 Y.4
N$12
  Top 0.3: U2.18 49.25,44 50,46 50,55.5 Y.3
N$13
  Top 0.3: U2.20 48.25,44 47.5,46 47.5,55.5 Y.2
N$14
  Top 0.3: U2.23 46.75,44 46.5,46 46.5,51 44.94,52.56 Y.1
N$15
  Top 0.178: C1.2 47,42 50.75,38.25 U2.10
N$16
  Top 0.178: C6.2 46,39.75 47.25,38.5 U2.3
N$17
  Top 0.178: R6.P$3 49.9,32.05 R3.2
N$18
  Top 0.178: U2.13 51.75,44 52.15,45.9 56.15,45.9 56.15,41.5 XD2.2
N$19
  Top 0.178: U2.14 51.25,44 51.75,46.3 56.55,46.3 56.55,39.5 XD1.2
N$20
  Top 0.178: U8.4 18.34,17.1 20,17.1 | 20,17.1 20.89,17.1 | 20.89,17.1 U8.2 | 20.1,17.1 20,17.1 | R30.2 23.9,17.1 20.89,17.1
N$21
  Top 0.3: U3.21 32.5,42.5 30.5,42.5 28.5,44.5 R10.1
N$22
  Top 0.3: U3.17 34.5,42.5 37,42.5 38.5,44 R11.1
N$23
  Top 0.3: U3.16 35,44 35.25,46 35.25,50.5 37.31,52.56 Z.7 Z.8
N$24
  Top 0.3: U3.18 34,44 34.75,46 34.77,46.02 Z.5 Z.6
N$26
  Top 0.3: U3.23 31.5,44 31.25,46 31.25,51 29.69,52.56 Z.1 Z.2
N$27
  Top 0.178: C7.2 31.75,42 35.5,38.25 U3.10
N$28
  Top 0.178: C10.2 30.75,39.75 32,38.5 U3.3
N$29
  Top 0.178: R12.P$2 TP2.TP U3.6
N$30
  Top 0.178: R9.2 34.75,31.65 R12.P$3
N$31
  Top 0.178: U3.13 36.5,44 36.9,45.9 40.9,45.9 40.9,41.5 YD2.2
N$32
  Top 0.178: U3.14 36,44 36.5,46.3 41.3,46.3 41.3,39.5 YD1.2
N$33
  Top 0.178: R33.2 37.95,4.55 STAT.A
N$34
  Top 0.178: U7.4 26.66,24 R37.2
N$36
  Top 0.178: LED4.A R39.2
N$37
  Top 0.178: R40.2 42.45,4.55 PWR.A
N$81
  Top 0.3: U4.21 16.5,42.5 14.5,42.5 12.5,44.5 R16.1
N$82
  Top 0.3: U4.17 18.5,42.5 21,42.5 22.5,44 R17.1
N$83
  Top 0.3: U4.16 19,44 19.25,46 19.25,50.5 21.31,52.56 E.7
N$84
  Top 0.3: U4.18 18,44 18.75,46 18.75,54.98 E.5
N$85
  Top 0.3: U4.20 17,44 16.25,46 16.25,54.98 E.3
N$86
  Top 0.3: U4.23 15.5,44 15.25,46 15.25,51 13.69,52.56 E.1
N$87
  Top 0.178: C12.2 15.75,42 19.5,38.25 U4.10
N$88
  Top 0.178: C14.2 14.75,39.75 16,38.5 U4.3
N$89
  Top 0.178: R18.P$2 TP4.TP U4.6
N$90
  Top 0.178: R15.2 14.85,31.4 14.85,31.15 15.75,30.25 17.5,30.25 18.35,31.1 R18.P$3
N$91
  Top 0.178: ZD2.2 24.9,41.5 24.9,45.9 20.9,45.9 20.5,44 U4.13
N$92
  Top 0.178: ZD1.2 25.3,39.5 25.3,46.3 20.5,46.3 20,44 U4.14
N$93
  Top 0.3: U5.21 63,42.5 61,42.5 59,44.5 R22.1
N$94
  Top 0.3: U5.17 65,42.5 67.5,42.5 69.5,44.5 R23.1
N$95
  Top 0.3: U5.16 65.5,44 65.75,46 65.75,50.5 67.81,52.56 X.4
N$96
  Top 0.3: U5.18 64.5,44 65.25,46 65.25,55 65.25,55.48 X.3
N$97
  Top 0.3: U5.20 63.5,44 62.75,46 62.75,55 62.75,55.48 X.2
N$98
  Top 0.3: U5.23 62,44 61.75,46 61.75,51 60.19,52.56 X.1
N$99
  Top 0.178: C16.2 62.25,42 66,38.25 U5.10
N$100
  Top 0.178: C18.2 61.25,39.75 62.5,38.5 U5.3
N$101
  Top 0.178: R24.P$2 64,36 | 64,36 TP5.TP | TP5.TP U5.6 | TP5.TP 64,36
N$102
  Top 0.178: R24.P$3 65.4,32.05 R21.2
N$103
  Top 0.178: U5.13 67,44 67.4,45.9 71.4,45.9 71.4,41.5 ED2.2
N$104
  Top 0.178: U5.14 66.5,44 67,46.3 71.8,46.3 71.8,39.5 ED1.2
N$105
  Top 0.178: U7.2 24.11,22.73 R27.2
N$107
  Top 0.178: LED2.A R29.2
N$108
  Top 0.5: U7.7 U7.8 21.15,27.1 19.75,28.5 11.75,28.5 10.75,27.5 | FAN.1 8.22,27.45 LED2.C
  Top 0.6: 10.75,27.5 LED2.C
N$111
  pour Top: 12.25,7.5 4.25,7.5 4.25,11.5 12.25,11.5
  pour Top: 12.25,7.2 23.5,7.2 23.5,11.8 12.25,11.8
N$112
  Top 0.178: R32.2 LED3.A
RESET
  Top 0.178: U1.20 52.26,23 52.5,23 58,17.5 58,16.75 58.75,16 60,16 60.5,15.5 60.5,14 60,13.5 58,13.5 56.73,12.23 ICSP.5 56.52,12.01 RESET.P$4 RESET.P$3
SCK
  Top 0.178: U1.11 51.28,14.75 ICSP.3
USB1_N
  Top 0.178: R1.2 50.01,8.96 arc45 50.07,9.12 arc45 49.98,9.34 49,10.33 arc45 48.58,10.5 48,10.5 arc-45 47.57,10.68 46.74,11.51 U1.4
USB1_P
  Top 0.178: U1.5 48.85,11.02 arc-11 49.19,10.74 50.43,9.5 arc-32 R2.2
VCC  (via drill 0.41, 0.6)
  Top 0.178: U4.11 20,38.25 20.62,38.88 | 20.62,38.88 21.25,39.5 ZD1.1 ZD2.1 v20.75,41.5 | C13.1 22,37.5 20.62,38.88 | 36.6,38.85 37.25,39.5 YD1.1 38.24,41 37.99,41.5 | 36.6,38.85 36,38.25 U3.11 | 36.6,38.85 37.95,37.5 C9.1 38.15,37.1 | 51.88,38.88 52.5,39.5 XD1.1 XD2.1 v52,41.5 | 51.88,38.88 51.25,38.25 U2.11 51.25,36.1 R3.1 | 51.88,38.88 53.25,37.5 C5.1 53.5,37.4 | 67.12,38.88 67.75,39.5 ED1.1 ED2.1 v67.25,41.5 | 67.12,38.88 66.5,38.25 U5.11 66.5,35.85 R21.1 | 67.12,38.88 68.5,37.5 C17.1 68.65,37.25 | U2.1 46.25,36.75 | 46.25,36.75 47.75,36.75 U2.4 47.75,40 v46.5,41.25 | U4.1 15,36.75 16.5,36.75 U4.4 16.5,39.25 v14.5,41.25 | U5.1 61.5,36.75 63,36.75 U5.4 63,40 v61.75,41.25 | v31.25,41.25 32.5,40 U3.4 32.5,36.75 | YD2.1 37.99,41.5 | 37.99,41.5 v36.75,41.5 | U6.1 | U1.52 35.67,16.52 | U1.3 47.1,9.97 C24.1 44.35,5.35 R40.1 | 46.17,11.07 U1.3 | U1.3 45.12,12 44.6,12 43.8,11.2 | U1.64 43.8,11.2 | 35.67,16.52 37.02,17.88 37.12,17.88 | 37.12,17.88 42.75,12.25 | 42.75,12.25 42.62,12.25 42.38,12 U1.62 40,9.62 C27.1 39.9,9.5 | 42.75,12.25 43.8,11.2 | 43.8,11.2 | C23.1 77.23,42 | R35.1 R34.1 13.6,23.9 15.75,21.75 15.75,19.5 16.5,18.75 29.65,18.75 R36.1 29.9,17.1 32,15 C25.1 | 33.25,14.75 C25.1 | ICSP.2 59.27,17.88 C26.1 53.25,23 52.75,23.5 51.65,23.5 U1.21 50.15,22 49.5,22 43.75,27.75 | 46.25,36.75 46.25,36.5 43.75,34 43.75,27.75 | 35.67,16.52 35.15,16 34,16 33.15,15.15 C25.1 | 37.12,17.88 35.75,19.25 35.75,19.75 43.75,27.75 | U3.1 31,36.75 32.5,36.75 | R9.1 33.65,33.35 32.5,34.5 32.5,36.75 | R15.1 12.75,31.9 v12.75,33.75
  Top 0.5: U6.1 77.23,42 77.23,40.68 C28.+ 74.8,38.25 v71.5,38.25
  Bottom 0.178: v31.25,41.25 31.25,42.5 | v46.5,41.25 46.5,42.5 | v61.75,41.25 61.75,42.5 | v67.25,41.5 67.25,42.5 | v52,41.5 52,42.5 | v36.75,41.5 36.75,42.5 | v20.75,41.5 20.75,42.5 | v12.75,33.75 12.75,35 14.25,36.5 14.25,41 v14.5,41.25
  Bottom 0.4: v14.5,41.25 15.75,42.5
  Bottom 0.5: 15.75,42.5 20.75,42.5 31.25,42.5 36.75,42.5 46.5,42.5 52,42.5 61.75,42.5 67.25,42.5 71.75,42.5 71.75,38.5 v71.5,38.25
X_ATT
  Top 0.178: U5.8 U5.9 65.5,34 64.5,33 58,33 57.5,33.5 55.75,33.5 49.5,27.25 48.72,27.25 U1.27 47.8,26.35
X_DIR
  Top 0.178: U5.24 61.25,45.9 57,45.9 57,38.75 57,37 51.75,31.75 48.75,28.75 46.88,28.75 U1.30
X_EN
  Top 0.178: U5.2 62,38.25 61.75,38.5 61.25,38.5 60,38.5 59.25,38.5 52,31.25 49,28.25 47.49,28.25 U1.29
X_MIN
  Top 0.178: X_MIN.2 10.15,47.12 10.15,39 15.9,33.25 19.5,33.25 25.25,33.25 31,27.5 31.85,27.5 U1.44 36.3,23.05
X_STEP
  Top 0.178: 47.25,26.6 47.25,26.9 U1.28 48.1,27.75 49.25,27.75 55.5,34 57.75,34 58.25,33.5 64.25,33.5 65,34.25 65,36.5 64.5,37 U5.7
Y_ATT
  Top 0.178: U2.8 U2.9 50.25,34.25 48.75,32.75 48.75,30.75 47.25,29.25 46.26,29.25 U1.31
Y_DIR
  Top 0.178: U2.24 46,45.9 41.75,45.9 41.75,39.25 41.75,37.25 41.5,37 41.5,28.99 U1.34
Y_EN
  Top 0.178: U2.2 46.75,38.25 46.5,38.5 43.75,38.5 42,36.75 42,29.6 U1.33
Y_MIN
  Top 0.178: Y_MIN.2 9.75,40.52 9.75,38.75 15.7,32.8 19.5,32.8 24.95,32.8 30.75,27 31.24,27 U1.45 35.75,22.5
Y_STEP
  Top 0.178: U2.7 49.25,37 49.75,36.5 49.75,34.5 49,33.75 48,33.75 46.5,32.25 46.5,30.6 U1.32
Z_ATT
  Top 0.178: U3.8 U3.9 35,36.75 36.25,35.5 36.75,35.5 38,34.25 38,31.38 U1.35
Z_DIR
  Top 0.178: U3.24 30.7,46 26.5,46 26.5,38 26.75,37.75 26.75,35.5 32.25,30 36,30 39.62,26.38 U1.38
Z_EN
  Top 0.178: U3.2 31.5,38.25 31.25,38.5 30.5,38.5 30.25,38.25 30.25,36 33.5,32.75 33.5,31 34,30.5 36.65,30.5 U1.37
Z_MIN
  Top 0.178: Z_MIN.2 10.98,36.77 12,35.75 12,31 13.25,29.75 14.25,29.75 17.75,29.75 20.25,32.25 24.75,32.25 30.5,26.5 30.62,26.5 U1.46 35.2,21.95
Z_STEP
  Top 0.178: U3.7 34,37 36,35 36.5,35 37.5,34 37.5,30.76 U1.36

### Text on the board
tNames: D2 | D2 | D2 | D2 | D1 | D1 | D1 | D1 | Brainwave
tDocu: 1.0 | BED | Designed by | Matthew Wilson | #E87600 | Open Source | GPL 2.0
bDocu: Step Mode | mode | D2 | D1 | thermistor | heater | full | 0 | 0 | half | 0 | 1 | 16x | 1 | 0 | 32x | 1 | 1 | stepper | Main | 800mA | Max Motor Current: | Bed | 12v | Max Motor Voltage: | 6v | Min Motor Voltage: